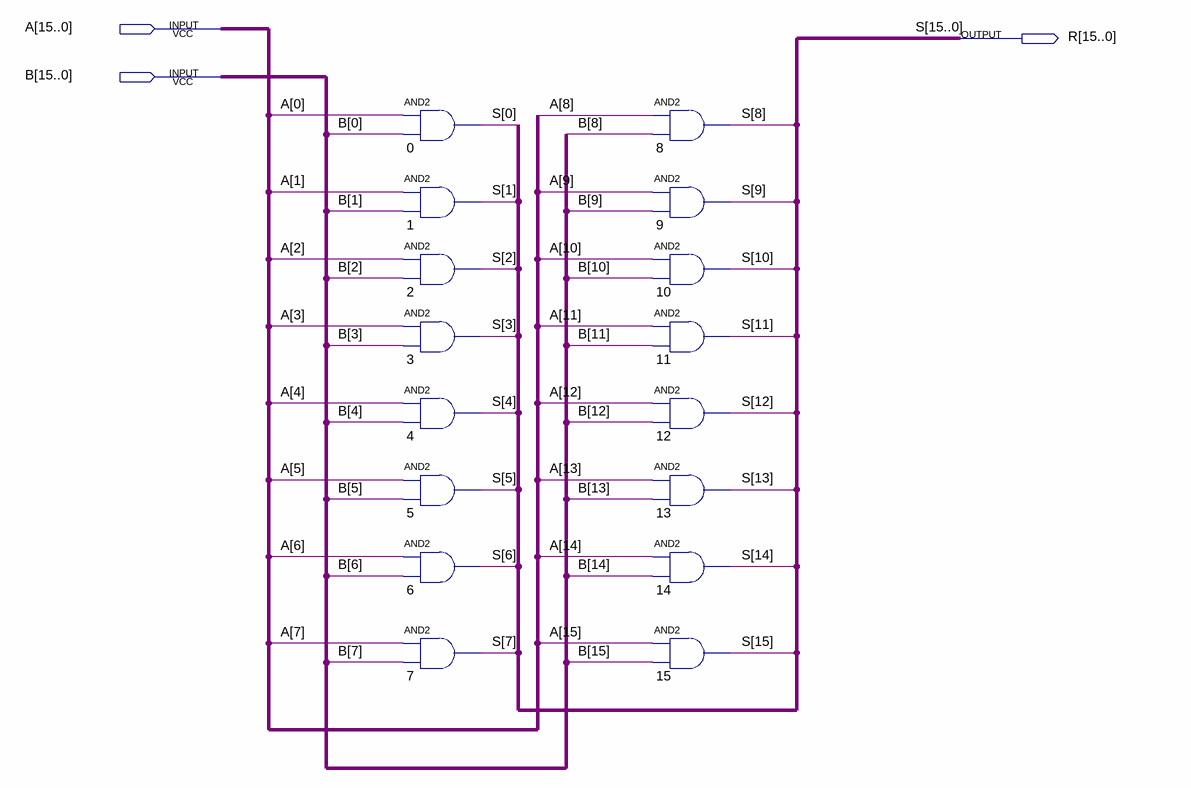
[diagram p0: schematic sheet]
// Quartus schematic AND16BIT.bdf as structural Verilog: 16 symbols, 3 pins
module AND16BIT (
  input  [15:0] A,
  input  [15:0] B,
  output [15:0] R
);

  and u_0 (R[0], A[0], B[0]);
  and u_1 (R[1], A[1], B[1]);
  and u_2 (R[2], A[2], B[2]);
  and u_3 (R[3], A[3], B[3]);
  and u_4 (R[4], A[4], B[4]);
  and u_5 (R[5], A[5], B[5]);
  and u_6 (R[6], A[6], B[6]);
  and u_7 (R[7], A[7], B[7]);
  and u_8 (R[8], A[8], B[8]);
  and u_9 (R[9], A[9], B[9]);
  and u_10 (R[10], A[10], B[10]);
  and u_11 (R[11], A[11], B[11]);
  and u_12 (R[12], A[12], B[12]);
  and u_13 (R[13], A[13], B[13]);
  and u_14 (R[14], A[14], B[14]);
  and u_15 (R[15], A[15], B[15]);

  // Other names for the same wires on the sheet: S[15:0] = R
endmodule
